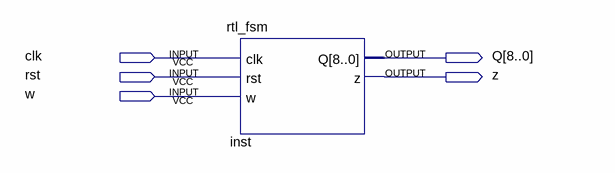
[diagram p0: schematic sheet]
// Quartus schematic Lab7Part1.bdf as structural Verilog: 1 symbols, 5 pins
module Lab7Part1 (
  input  clk,
  input  rst,
  input  w,
  output [8:0] Q,
  output z
);

  rtl_fsm inst (.clk(clk), .rst(rst), .w(w), .Q(Q), .z(z));
endmodule
